# Altium schematic sheet scheme.SchDoc
size 420 x 297 mm; Address1: Address1; Address2: Address2; Address3: Address3; Address4: Address4; DocumentNumber: АБВГ.123456.001 Э3; SheetNumber: 1; Scale: 1:1; DocumentType: Схема электрическая принципиальная; FirstReferrence: АБВГ.123456.001
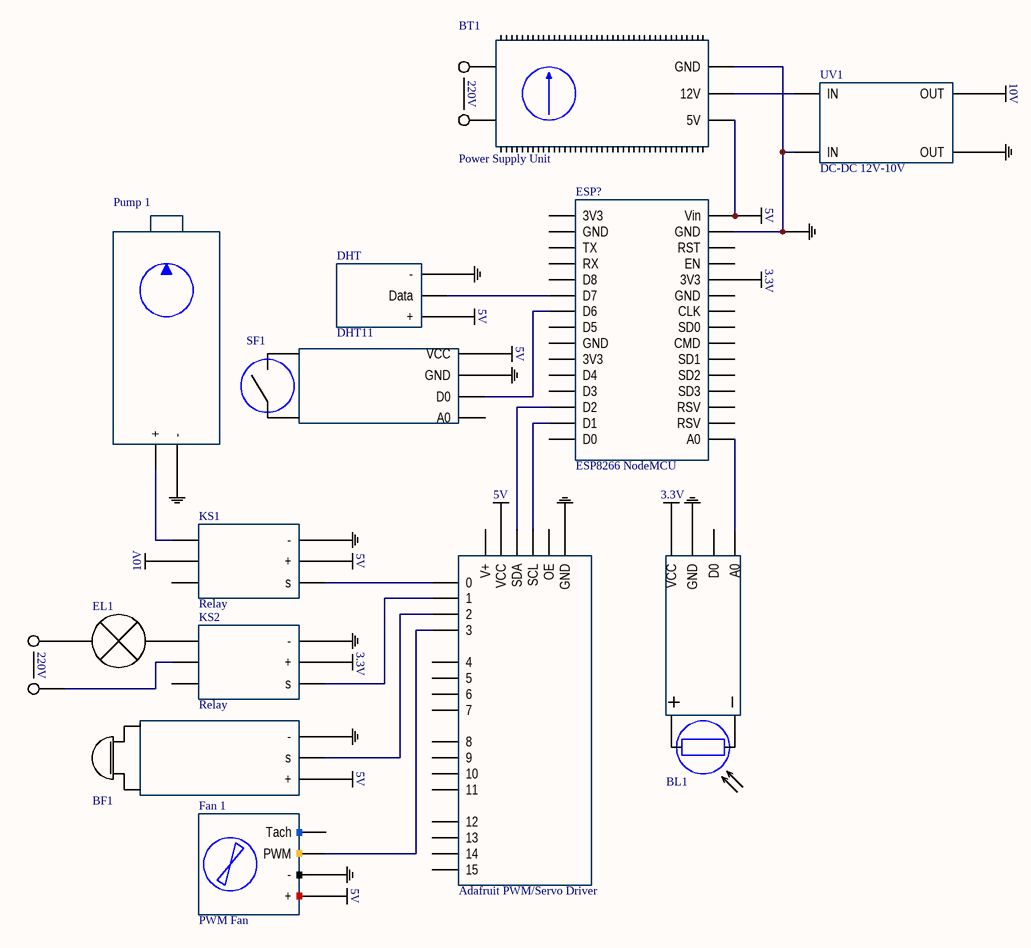
[diagram p0: scheme.SchDoc]

## Parts
(Parts that share a designator on the sheet are numbered #1, #2 ... from top to bottom, then left to right.)
3V#1  [3V]  (value not drawn)
3V#2  [3V]  (value not drawn)
3V#3  [3V]  (value not drawn)
5V#1  [5V]  (value not drawn)
5V#2  [5V]  (value not drawn)
5V#3  [5V]  (value not drawn)
5V#4  [5V]  (value not drawn)
5V#5  [5V]  (value not drawn)
*#1  [10V]  (value not drawn)
*#2  [10V]  (value not drawn)
*#3  [220V]  (value not drawn)
?#1  [5V]  (value not drawn)
?#2  [5V]  (value not drawn)
Adafruit_PWM/Servo_Driver  (no value)
BF1  Humidifier-Ruzzer  (value not drawn)
BL1  [Light sensor] MH-Semsor-Series Flying Fish  (value not drawn)
BT1  Power Supply Unit
DHT  DHT11
EL1  [Lamp]  (value not drawn)
ESP?  ESP8266 NodeMCU
Fan_1  PWM Fan
GND#1  [GND]  (value not drawn)
GND#2  [GND]  (value not drawn)
GND#3  [GND]  (value not drawn)
GND#4  [GND]  (value not drawn)
GND#5  [GND]  (value not drawn)
GND#6  [GND]  (value not drawn)
GND#7  [GND]  (value not drawn)
GND#8  [GND]  (value not drawn)
GND#9  [GND]  (value not drawn)
GND?#1  [GND]  (value not drawn)
GND?#2  [GND]  (value not drawn)
KS1  Relay
KS2  Relay
o  [o]  (value not drawn)
o?  [o]  (value not drawn)
Pump_1  [Pump]  (value not drawn)
SF1  Reed Switch water sensor  (value not drawn)
UV1  DC-DC 12V-10V

## Nets
Net3V#1_1: 3V#1.1(+) ESP?.11(3V3)
Net3V#2_1: 3V#2.1(+) BL1.4(VCC)
Net3V#3_1: 3V#3.1(+) KS2.2(+)
Net5V#1_1: 5V#1.1(+) BT1.1(5V) ESP?.15(Vin)
Net5V#2_1: 5V#2.1(+) DHT.1(+)
Net5V#3_1: 5V#3.1(+) Adafruit_PWM/Servo_Driver.5(VCC)
Net5V#4_1: 5V#4.1(+) KS1.2(+)
Net*#1_1: *#1.1(+) UV1.3(OUT)
Net*#2_1: *#2.1(+) KS1.5(o)
Net?#1_1: ?#1.1(+) SF1.4(VCC)
Net?#2_1: ?#2.1(+) BF1.1(+)
NetAdafruit_PWM/Servo_Driver_1: Adafruit_PWM/Servo_Driver.1(GND) GND#5.1(-)
NetAdafruit_PWM/Servo_Driver_3: Adafruit_PWM/Servo_Driver.3(SCL) ESP?.17(D1)
NetAdafruit_PWM/Servo_Driver_4: Adafruit_PWM/Servo_Driver.4(SDA) ESP?.18(D2)
NetAdafruit_PWM/Servo_Driver_7: Adafruit_PWM/Servo_Driver.7(0) KS1.1(s)
NetAdafruit_PWM/Servo_Driver_8: Adafruit_PWM/Servo_Driver.8(1) KS2.1(s)
NetAdafruit_PWM/Servo_Driver_9: Adafruit_PWM/Servo_Driver.9(2) BF1.2(s)
NetAdafruit_PWM/Servo_Driver_10: Adafruit_PWM/Servo_Driver.10(3) Fan_1.3(PWM)
NetBF1_3: BF1.3(-) GND?#2.1(-)
NetBL1_1: BL1.1(A0) ESP?.1(A0)
NetBL1_3: BL1.3(GND) GND#6.1(-)
NetBT1_2: BT1.2(12V) UV1.1(IN)
NetBT1_2: BT1.2(GND) ESP?.14(GND) GND#2.1(-) UV1.2(IN)  [a separate net that carries the same name]
NetDHT_2: DHT.2(Data) ESP?.25(D7)
NetDHT_3: DHT.3(-) GND#3.1(-)
NetEL1_1: EL1.1 KS2.6(o)
NetEL1_1: EL1.1 o.1(o)  [a separate net that carries the same name]
NetESP?_24: ESP?.24(D6) SF1.2(D0)
NetGND#1_1: GND#1.1(-) UV1.4(OUT)
NetGND#4_1: GND#4.1(-) Pump_1.2(-)
NetGND#7_1: GND#7.1(-) KS1.3(-)
NetGND#8_1: GND#8.1(-) KS2.3(-)
NetGND?#1_1: GND?#1.1(-) SF1.3(GND)
NetKS1_6: KS1.6(o) Pump_1.1(+)
NetKS2_5: KS2.5(o) o?.1(o)

Not connected (* = marked no-connect by the designer): 5V#5 1(+); Adafruit_PWM/Servo_Driver 2(OE) 6(V+) 11(4) 12(5) 13(6) 14(7) 15(8) 16(9) 17(10) 18(11) 20(13) 21(14) 22(15); BL1 2(D0); ESP? 2(RSV) 3(RSV) 4(SD3) 5(SD2) 6(SD1) 7(CMD) 8(SD0) 9(CLK) 10(GND) 12(EN) 13(RST) 16(D0) 19(D3) 20(D4) 21(3V3) 22(GND) 23(D5) 26(D8) 27(RX) 28(TX) 29(GND) 30(3V3); Fan_1 1(+) 2(-) 4(Tach); GND#9 1(-); KS1 4(o); KS2 4(o); SF1 1(A0)

## Notes on the sheet
- Перв. примен.
- Справ. №
- Подп. и дата
- Инв. № дубл.
- Взам. инв. №
- Разраб.
- Изм.
- Лист
- № докум.
- Подп.
- Дата
- Лит.
- Масса
- Масштаб
- Пров.
- Т.контр.
- Листов
- Инв. № подл.
- Утв.
- Н.контр.
- 2.106-A3
- Копировал
- Формат А3
- (in symbol [3V]) 3.3V
- (in symbol [5V]) 5V
- (in symbol [10V]) 10V
- (in symbol [220V]) 220V
- (in symbol [Powr Supply Unit]) 220V

## Library data of the parts
Adafruit_PWM/Servo_Driver = [Driver] Adafruit PWM/Servo Driver
BF1 = [Humidifier]
BT1 = [Powr Supply Unit]
DHT = [Temp+humidity sensor] DHT11
ESP? = [Microcontroller] ESP8266 NodeMCU
Fan_1 = [Fan] FAN-4020-PWM-5V DC Brushless Waveshare
KS1 KS2 = [Relay] Songle SRD-05VDC-SL-C
SF1 = [Water sensor]
UV1 = [Voltage regulator]  LM2596 DC-DC